# EAGLE design RH046.2 (EAGLE 7.7.0)
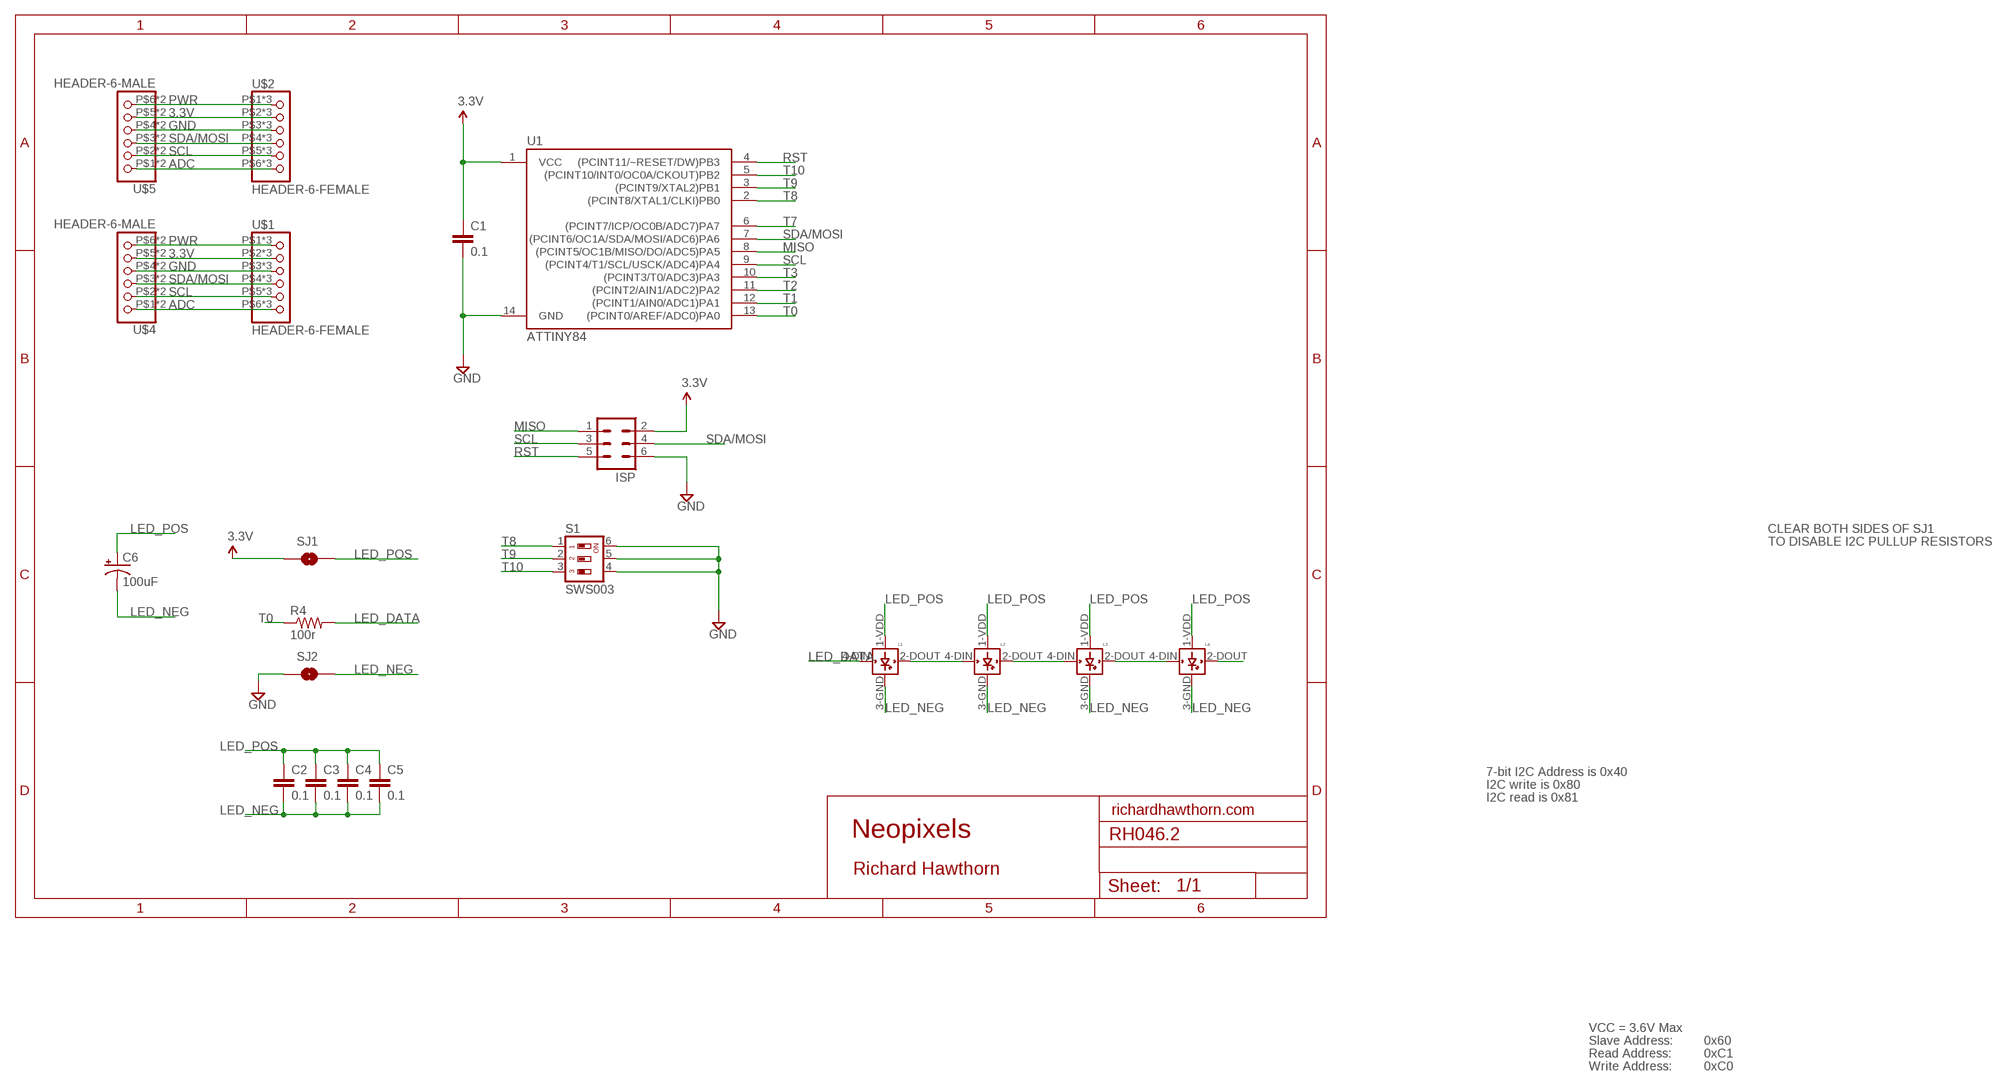
[diagram p0: schematic, sheet 1]

## Parts
C1  0.1  CAP0603-CAP  [0603-CAP]
C2  0.1  CAP0603-CAP  [0603-CAP]
C3  0.1  CAP0603-CAP  [0603-CAP]
C4  0.1  CAP0603-CAP  [0603-CAP]
C5  0.1  CAP0603-CAP  [0603-CAP]
C6  100uF  100UF-10V-10%(TANT)  [EIA7343]
ISP  MA03-2  [MA03-2]
L1  WS2812B  [WS2812B]
L2  WS2812B  [WS2812B]
L3  WS2812B  [WS2812B]
L4  WS2812B  [WS2812B]
R4  100r  RESISTOR0603-RES  [0603-RES]
S1  SWS003  [SMS-003]
SJ1  SOLDERJUMPERNO  [SJ_2S-NO]
SJ2  SOLDERJUMPERNO  [SJ_2S-NO]
U1  ATTINY84  [SO14]
U$1  HEADER-6-FEMALE  [2MMHEADER6]
U$2  HEADER-6-FEMALE  [2MMHEADER6]
U$4  HEADER-6-MALE  [2MMHEADERPIN6]
U$5  HEADER-6-MALE  [2MMHEADERPIN6]

## Nets
3.3V: C1.1 ISP.2 SJ1.1 U1.1(VCC) U$1.P$2 U$1.P$10 U$1.P$18 U$2.P$2 U$2.P$10 U$2.P$18 U$4.P$5 U$4.P$13 U$5.P$5 U$5.P$13
ADC: U$1.P$6 U$1.P$14 U$1.P$22 U$2.P$6 U$2.P$14 U$2.P$22 U$4.P$1 U$4.P$9 U$5.P$1 U$5.P$9
GND [power]: C1.2 ISP.6 S1.4 S1.5 S1.6 SJ2.1 U1.14(GND) U$1.P$3 U$1.P$11 U$1.P$19 U$2.P$3 U$2.P$11 U$2.P$19 U$4.P$4 U$4.P$12 U$5.P$4 U$5.P$12
LED-OUT-1: L1.2-DOUT(DOUT) L2.4-DIN(DIN)
LED-OUT-2: L3.2-DOUT(DOUT) L4.4-DIN(DIN)
LED-OUT-3: L4.2-DOUT(DOUT)
LED_DATA: L1.4-DIN(DIN) R4.2
LED_NEG [power]: C2.2 C3.2 C4.2 C5.2 C6.C(-) L1.3-GND(GND) L2.3-GND(GND) L3.3-GND(GND) L4.3-GND(GND) SJ2.2
LED_POS [power]: C2.1 C3.1 C4.1 C5.1 C6.A(+) L1.1-VDD(VDD) L2.1-VDD(VDD) L3.1-VDD(VDD) L4.1-VDD(VDD) SJ1.2
MISO: ISP.1 U1.8((PCINT5/OC1B/MISO/DO/ADC5)PA5)
N$6: L2.2-DOUT(DOUT) L3.4-DIN(DIN)
PWR [power]: U$1.P$1 U$1.P$9 U$1.P$17 U$2.P$1 U$2.P$9 U$2.P$17 U$4.P$6 U$4.P$14 U$5.P$6 U$5.P$14
RST: ISP.5 U1.4((PCINT11/~RESET/DW)PB3)
SCL: ISP.3 U1.9((PCINT4/T1/SCL/USCK/ADC4)PA4) U$1.P$5 U$1.P$13 U$1.P$21 U$2.P$5 U$2.P$13 U$2.P$21 U$4.P$2 U$4.P$10 U$5.P$2 U$5.P$10
SDA/MOSI: ISP.4 U1.7((PCINT6/OC1A/SDA/MOSI/ADC6)PA6) U$1.P$4 U$1.P$12 U$1.P$20 U$2.P$4 U$2.P$12 U$2.P$20 U$4.P$3 U$4.P$11 U$5.P$3 U$5.P$11
T0: R4.1 U1.13((PCINT0/AREF/ADC0)PA0)
T1: U1.12((PCINT1/AIN0/ADC1)PA1)
T2: U1.11((PCINT2/AIN1/ADC2)PA2)
T3: U1.10((PCINT3/T0/ADC3)PA3)
T7: U1.6((PCINT7/ICP/OC0B/ADC7)PA7)
T8: S1.1 U1.2((PCINT8/XTAL1/CLKI)PB0)
T9: S1.2 U1.3((PCINT9/XTAL2)PB1)
T10: S1.3 U1.5((PCINT10/INT0/OC0A/CKOUT)PB2)

## Notes on the sheet
- CLEAR BOTH SIDES OF SJ1
- TO DISABLE I2C PULLUP RESISTORS
- 7-bit I2C Address is 0x40
- I2C write is 0x80
- I2C read is 0x81
- richardhawthorn.com
- Neopixels
- Richard Hawthorn
- VCC = 3.6V Max
- Slave Address: | 0x60
- Read Address: | 0xC1
- Write Address: | 0xC0

## Library data of the parts
C1-C5 = LowPowerLab:CAP: Capacitor Standard 0603 ceramic capacitor, and 0.1" leaded capacitor.
C6 = SparkFun-Capacitors:100UF-10V-10%(TANT): CAP-07890; PROD_ID: CAP-07890
ISP = Richards:MA03-2: PIN HEADER; OC_FARNELL: unknown; OC_NEWARK: unknown
L1-L4 = adafruit:WS2812B
R4 = LowPowerLab:RESISTOR: Resistor Basic schematic elements and footprints for 0603, 1206, and PTH resistors.
S1 = smd-special:SWS003: SMD Dip Switch 3 pol.
SJ1 SJ2 = SparkFun-Retired:SOLDERJUMPER: Solder Jumper Standard SMD solder jumper. Used to automate production. Two varients : Normally Open and Normally Closed are the same, but have different paste layers. NC will have a large amount of paste and should jumper during reflow.
U1 = SparkFun-DigitalIC:ATTINY84: Atmel 14-pin 2/4/8kB flash uC
U$1 U$2 = Richards:HEADER-6-FEMALE
U$4 U$5 = Richards:HEADER-6-MALE

## Net classes
1 power: width 0.381 mm, clearance 0.254 mm

## Board
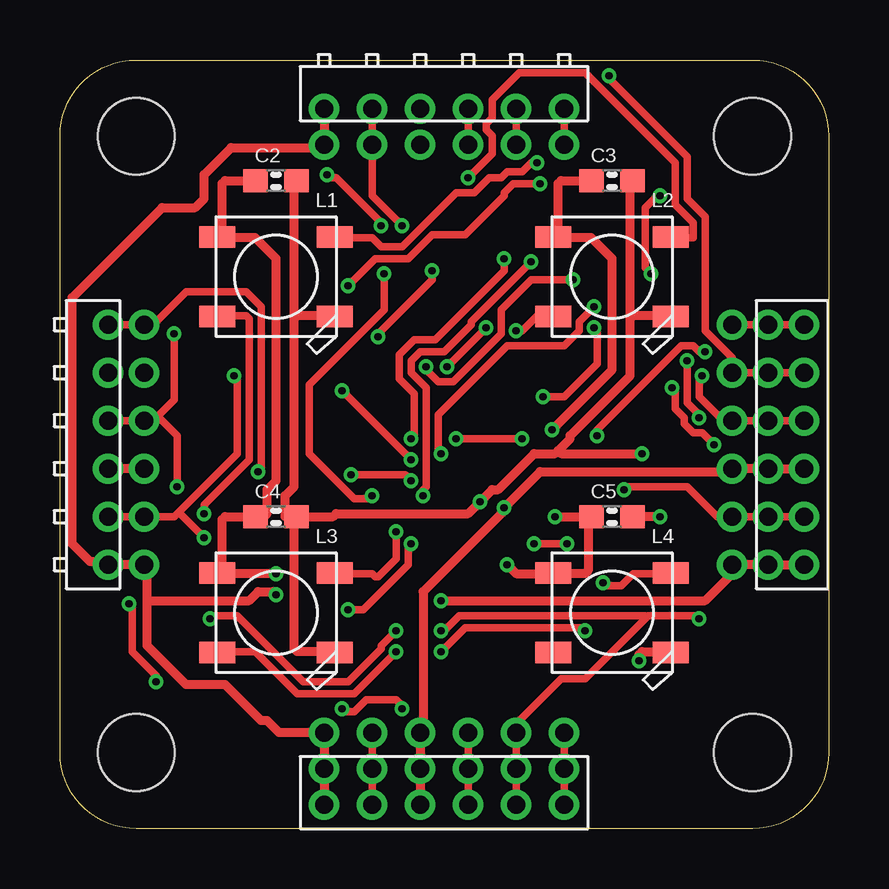
[diagram p1: board, top side]
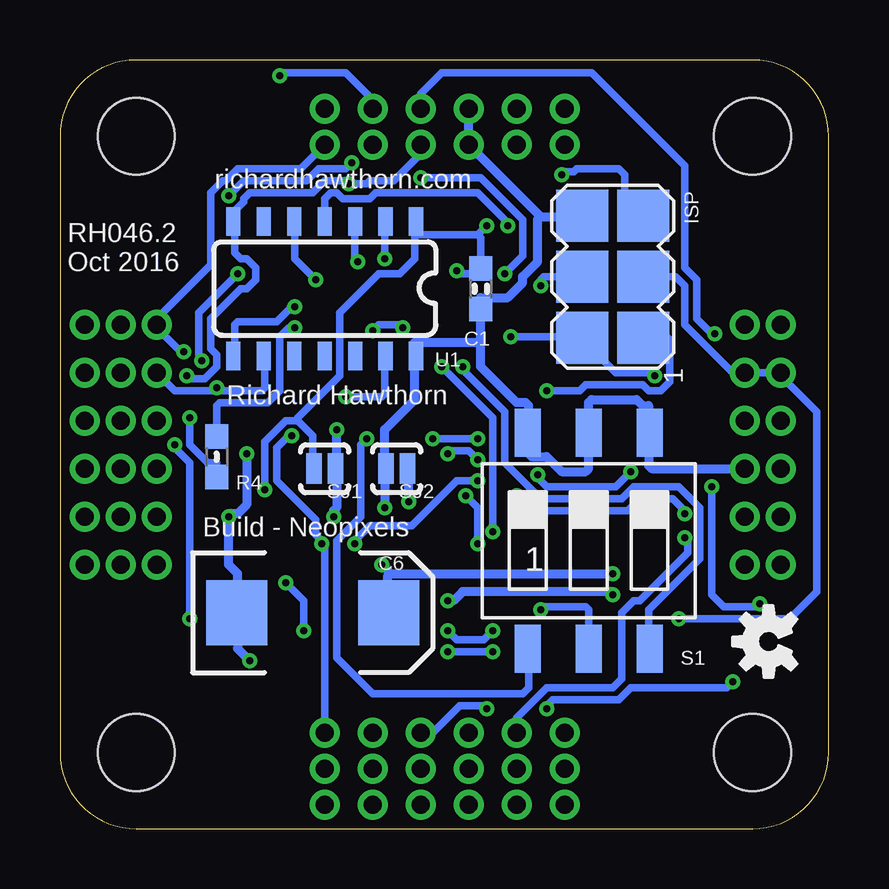
[diagram p2: board, bottom side, seen from below]

Size 32.03 x 32.03 mm. Coordinates in mm from the lower left corner, seen from the top.
Outline: 0,3.17 0,28.86 arc-90 3.17,32.03 28.86,32.03 arc-90 32.03,28.86 32.03,3.17 arc-90 28.86,0 3.17,0 arc-90 0,3.17
Copper layers (1*16): Top 0.035mm / dielectric 1.5mm / Bottom 0.035mm
Design rules "ITEADstudio_DRC *": minimum track width 12mil, minimum drill 12mil, track to track 6mil, track to pad 6mil, pad to pad 6mil, via to via 6mil, smd to smd 0mil, copper to edge 10mil, drill to drill 10mil, minimum pad ring 10mil, minimum via ring 6mil, stop-mask expansion 2mil, vias tented up to drill 100mil, thermal gap 15mil
Holes 3.2 mm at 3.17,3.17 28.86,3.17 3.17,28.86 28.86,28.86
tRestrict: area 0,0 to 5.7,5.7; area 26.3,0 to 32,5.7; area 26.3,26.3 to 32,32; area 0,26.3 to 5.7,32
bRestrict: area 0,26.3 to 5.7,32; area 26.3,26.3 to 32,32; area 26.3,0 to 32,5.7; area 0,0 to 5.7,5.7

### Footprints (pad centres in the part's own frame; a part is rotated, then mirrored left to right if it is on the bottom)
0603-CAP = smd 1.016 x 0.965: 1 -0.85,0; 2 0.85,0
EIA7343 = smd 2.55 x 2.7: A 3.17,0; C -3.17,0
MA03-2 = smd 2.159 x 2.159: 1 -2.54,-1.27; 2 -2.54,1.27; 3 0,-1.27; 4 0,1.27; 5 2.54,-1.27; 6 2.54,1.27
WS2812B = smd 1.5 x 0.9: 1-VDD 2.45,-1.65; 2-DOUT 2.45,1.65; 3-GND -2.45,1.65; 4-DIN -2.45,-1.65
0603-RES = smd 1.016 x 0.965: 1 -0.85,0; 2 0.85,0
SMS-003 = smd 1.092 x 2.007: 1 -2.54,-4.496; 2 0,-4.496; 3 2.54,-4.496; 4 2.54,4.496; 5 0,4.496; 6 -2.54,4.496
SJ_2S-NO = smd 0.635 x 1.27: 1 -0.45,0; 2 0.45,0
SO14 = smd 0.6 x 1.2: 1 -3.81,-2.8; 2 -2.54,-2.8; 3 -1.27,-2.8; 4 0,-2.8; 5 1.27,-2.8; 6 2.54,-2.8; 7 3.81,-2.8; 8 3.81,2.8; 9 2.54,2.8; 10 1.27,2.8; 11 0,2.8; 12 -1.27,2.8; 13 -2.54,2.8; 14 -3.81,2.8
2MMHEADER6 = drill 0.75: P$1 1,5; P$2 1,3; P$3 1,1; P$4 1,-1; P$5 1,-3; P$6 1,-5; P$9 -0.5,5; P$10 -0.5,3; P$11 -0.5,1; P$12 -0.5,-1; P$13 -0.5,-3; P$14 -0.5,-5; P$17 -2,5; P$18 -2,3; P$19 -2,1; P$20 -2,-1; P$21 -2,-3; P$22 -2,-5
2MMHEADERPIN6 = drill 0.75: P$1 1,5; P$2 1,3; P$3 1,1; P$4 1,-1; P$5 1,-3; P$6 1,-5; P$9 -0.5,5; P$10 -0.5,3; P$11 -0.5,1; P$12 -0.5,-1; P$13 -0.5,-3; P$14 -0.5,-5

### Placement (x,y rotation side)
C1  14.5,22.5 270 bottom
C2  9,27 0 top
C3  23,27 0 top
C4  9,13 0 top
C5  23,13 0 top
C6  21.5,9 0 bottom
ISP  9,23 90 bottom
L1  9,23 180 top
L2  23,23 180 top
L3  9,9 180 top
L4  23,9 180 top
R4  25.5,15.5 270 bottom
S1  10,12 0 bottom
SJ1  21,15 0 bottom
SJ2  18,15 0 bottom
U1  21,22.5 180 bottom
U$1  29,16 180 top
U$2  16,3 90 top
U$3  [OSHW-LOGO-S]  2.5,7.8 90 bottom
U$4  16,29.5 270 top
U$5  2.5,16 0 top

### Tracks (layer width: path | path; a pad name or v marks a point on that pad's centre or on a via)
3.3V  (via drill 0.3)
  Top 0.305: v23.5,14.12 23.62,14.25 26.12,14.25 27.38,13 U$1.P$2 U$1.P$10 U$1.P$18 | U$2.P$18 U$2.P$10 U$2.P$2 | U$4.P$13 U$4.P$5 13,26.38 v14.25,25.12 | U$5.P$13 U$5.P$5 4.75,13 4.94,13.19 | v13.25,20.5 13.25,20.62 15.5,22.88 v15.5,23.25 | 4.94,13.19 7.38,15.62 7.38,18.75 v7.25,18.88 | 4.94,13.19 v6,12.12
  Bottom 0.305: 22.12,17 21.5,16.38 21.5,15 SJ1.1 | 22.12,17 22.62,17 23.5,16.12 v23.5,14.12 | 14.62,24.75 14.5,24.62 C1.1 14.5,23.12 15.38,23.12 v15.5,23.25 | 17.25,24.75 14.62,24.75 | 17.25,24.75 17.25,25.25 U1.1 | v13.25,20.5 10.38,20.5 ISP.2 10.12,20.5 9.5,20.5 9.38,20.38 9.38,19.5 8.88,19 7.38,19 v7.25,18.88 | 14.62,24.75 v14.25,25.12 | U$2.P$2 13,4.62 11.75,5.88 9,5.88 8.62,6.25 8.62,9 8.12,9.5 7.88,9.5 5.88,11.5 5.88,12 v6,12.12 | 17.25,24.75 17.25,23.75 17.88,23.12 18.75,23.12 20.38,21.5 20.38,18.88 22.12,17.12 22.12,17
ADC  (via drill 0.3)
  Top 0.305: U$4.P$9 U$4.P$1 | U$1.P$6 U$1.P$14 U$1.P$22 | U$5.P$9 U$5.P$1 3.88,21 5.25,22.38 7.75,22.38 8.38,21.75 8.38,15 v8.25,14.88 | U$2.P$6 U$2.P$14 U$2.P$22 | v12.12,14.75 14.38,14.75 v14.62,14.5 | v21.12,11.88 v19.75,11.88 | v26.88,19.88 26.62,19.88 26.38,20.12 25.88,20.12 22.38,16.62 v22.38,16.38
  Bottom 0.305: U$4.P$1 22,27.5 24.62,27.5 25.12,27 25.25,27 25.75,26.5 25.75,23.5 28,21.25 U$1.P$6 28,20.88 27,19.88 v26.88,19.88 | v8.25,14.88 8.88,14.25 11.75,14.25 12.12,14.62 v12.12,14.75 | v14.62,14.5 15.5,14.5 17.38,12.62 19.12,12.62 19.75,12 v19.75,11.88 | U$2.P$6 21,11.75 v21.12,11.88 21.12,12 21.38,12.25 21.38,12.88 23,14.5 23,15.88 22.5,16.38 v22.38,16.38
GND  (via drill 0.3)
  Top 0.381: U$1.P$19 U$1.P$11 U$1.P$3 27.88,14.88 20,14.88 v18.5,13.38 18.5,13.25 15.12,9.88 15.12,4.12 U$2.P$3 U$2.P$11 U$2.P$19 | U$5.P$4 U$5.P$12
  Bottom 0.381: 12,25.5 10.38,25.5 ISP.6 | 12,25.5 U$4.P$4 U$4.P$12 | 14.5,20.25 14.5,19.25 13,17.75 12.62,17.75 12.5,17.62 12.5,16.5 S1.6 12.5,16.38 12.5,15.62 12.38,15.5 11.75,15.5 11.12,14.88 10.12,14.88 10,15 S1.5 10,17.75 9.88,17.88 8,17.88 7.75,17.62 7.5,17.62 7.5,16.5 S1.4 7.5,16.38 7.5,15.12 7.38,15 U$5.P$4 | 14.5,20.25 C1.2 14.5,22.12 13.38,22.12 12.75,22.75 12.75,23 12.12,23.62 12.12,25.38 12,25.5 | 14.5,20.25 17.25,20.25 17.25,19.88 U1.14 17.25,19.62 17.25,17.88 18.5,16.62 18.5,15 SJ2.1 18.5,14.88 v18.5,13.38
LED-OUT-1  (via drill 0.3)
  Top 0.305: v17,27.12 18,28.12 18,28.88 17.75,29.12 17.75,29.38 18,29.62 18,30.38 19.12,31.5 21.88,31.5 25.62,27.75 25.62,26 26.38,25.25 26.38,24.62 25.5,24.62 L2.4-DIN | v13.5,23.12 13.5,21.62 10.38,18.5 10.38,15.62 12.25,13.75 12.88,13.75 v13,13.88 | v6,13.12 6,13.5 7.88,15.38 7.88,21.25 7.75,21.38 6.62,21.38 L1.2-DOUT
  Bottom 0.305: v17,27.12 14.5,27.12 12.75,25.38 12.75,23.88 v13.5,23.12 | v13,13.88 12.88,13.88 12.25,13.25 8.38,13.25 7.88,13.75 6.5,13.75 6,13.25 v6,13.12
LED-OUT-2  (via drill 0.3)
  Top 0.305: v14,7.38 12.25,5.62 9.88,5.62 8.12,7.38 6.62,7.38 L3.2-DOUT | v15.88,7.38 16.88,8.38 21.75,8.38 v21.88,8.25 | v22.62,10.25 22.75,10.12 23.38,10.12 23.88,10.62 25.38,10.62 L4.4-DIN
  Bottom 0.305: v15.88,7.38 v14,7.38 | v21.88,8.25 21.88,9.5 v22.62,10.25
LED_DATA  (via drill 0.3)
  Top 0.305: v26.62,17.12 26.62,17.25 26.12,17.75 v26.12,19.5 | v24.62,23.12 24.38,23.38 24.38,25.88 24.88,26.38 v25,26.38 | v19.88,27.75 19.62,27.75 19.25,27.38 18.62,27.38 18.38,27.12 17.88,27.12 17.25,26.5 16.5,26.5 14.25,24.25 13.38,24.25 13,24.62 11.5,24.62 L1.4-DIN
  Bottom 0.305: R4.2 25.5,15.25 25.88,15.25 26.62,16 v26.62,17.12 | v26.12,19.5 26.12,19.62 26.25,19.75 26.25,21.5 v24.62,23.12 | v25,26.38 24.38,27 21.75,27 21.25,27.5 20.12,27.5 v19.88,27.75
LED_NEG  (via drill 0.3)
  Top 0.381: v25,13 C5.2 | v24.12,7 24.12,7.25 24.25,7.38 25.38,7.38 L4.3-GND | 23.88,21.38 23.75,21.5 23.75,27 C3.2 | 23.88,21.38 25.38,21.38 L2.3-GND | 9.88,21.38 9.75,21.5 9.75,27 C2.2 | 9.88,21.38 11.38,21.38 L1.3-GND | C4.2 9.75,13 9.75,7.5 9.88,7.38 11.38,7.38 L3.3-GND | C4.2 11.38,13 11.5,13.12 17,13.12 v17.5,13.62 18,14.12 18.25,14.12 19.75,15.62 20.62,15.62 20.75,15.75 | C4.2 9.38,13 9.38,13.88 9.75,14.25 9.75,21.25 9.88,21.38 | 20.75,15.75 21.25,16.25 21.25,16.38 23.75,18.88 23.75,21.25 23.88,21.38 | v24.25,15.62 20.88,15.62 20.75,15.75
  Bottom 0.381: v24.12,7 24.62,7.5 24.62,8.88 C6.C 24.62,9 24.62,10.62 25,11 v25,13 24.88,13.12 24.62,13.12 24.25,13.5 v24.25,15.62 | v17.5,13.62 17.5,15 SJ2.2
LED_POS  (via drill 0.3)
  Top 0.381: C3.1 20.88,27 20.75,26.88 20.75,24.62 20.62,24.62 L2.1-VDD 20.88,24.62 22.12,24.62 23,23.75 23,19.12 v20.5,16.62 | v20.62,13 C5.1 22,12.88 22,10.75 21.88,10.62 20.62,10.62 L4.1-VDD 20.38,10.62 19,10.62 v18.62,11 | C2.1 6.88,27 6.75,26.88 6.75,24.62 6.62,24.62 L1.1-VDD 6.88,24.62 8.12,24.62 9,23.75 9,14.5 8.62,14.12 8.62,13.12 8.5,13 C4.1 6.88,13 6.75,12.88 6.75,10.62 6.62,10.62 L3.1-VDD 6.88,10.62 v9,10.62
  Bottom 0.381: v20.62,13 20.62,13.25 20.5,13.38 20.5,15 SJ1.2 20.5,15.12 v20.5,16.62 | 18.25,10.62 v9,10.62 | 18.25,10.62 18.38,10.5 18.38,9 C6.A | 18.25,10.62 v18.62,11
MISO  (via drill 0.3)
  Top 0.305: v22.25,21.75 21.62,21.12 21.62,20.75 21,20.12 18.62,20.12 15.75,17.25 15.75,15.75 v15.88,15.62 | v11.75,18.25 v14.62,15.38
  Bottom 0.305: v22.25,21.75 22.38,21.75 23,21.12 24.62,21.12 24.75,21 24.75,19.75 U1.8 | v15.88,15.62 15.75,15.75 15,15.75 v14.62,15.38 | v11.75,18.25 10.38,18.25 10.12,18.5 7.75,18.5 7.5,18.25 7,18.25 6.62,18.62 6.62,20.38 6.75,20.5 7.62,20.5 ISP.1
N$6  (via drill 0.3)
  Top 0.305: v19,20.75 19.25,20.75 19.88,21.38 20.5,21.38 L2.2-DOUT | v16.12,19.25 v17.75,20.88 | v14,12.38 14,11.25 13.25,10.5 13.12,10.5 13,10.62 11.5,10.62 L3.4-DIN
  Bottom 0.305: v19,20.75 18.75,21 17.88,21 v17.75,20.88 | v16.12,19.25 14,17.12 v14,12.38
PWR  (via drill 0.3)
  Top 0.381: U$1.P$17 U$1.P$9 U$1.P$1 27.88,10.88 27.88,10.5 26.88,9.5 v15.88,9.5 | U$4.P$14 U$4.P$6 10.88,28.38 7.12,28.38 6,27.25 6,26.25 5.62,25.88 4.25,25.88 0.5,22.12 0.5,11.88 1.25,11.12 1.88,11.12 U$5.P$14 U$5.P$6 3.62,10.88 3.62,9.5 | U$2.P$17 U$2.P$9 U$2.P$1 9.12,4 8.62,4.5 8.38,4.5 6.88,6 5.25,6 3.62,7.62 3.62,9.5 | v9,9.75 8.88,9.88 8.25,9.88 7.88,9.5 3.62,9.5
  Bottom 0.381: v15.88,9.5 15.62,9.5 15.25,9.88 9.12,9.88 v9,9.75
RST  (via drill 0.3)
  Top 0.305: v13.38,25.12 13.38,25.25 11.5,27.12 11.25,27.12 v11.12,27.25
  Bottom 0.305: U1.4 21,26.25 20.75,26.5 20.5,26.5 20.25,26.25 19.12,26.25 18.88,26.5 14.62,26.5 13.38,25.25 v13.38,25.12 | v11.12,27.25 11,27.38 10.62,27.38 10.5,27.5 8.75,27.5 8.5,27.25 8.5,25.5 7.75,25.5 ISP.5
SCL  (via drill 0.3)
  Top 0.305: U$2.P$21 U$2.P$13 U$2.P$5 19,4.38 20.88,6.25 21.88,6.25 24.44,8.81 | U$4.P$10 U$4.P$2 | U$1.P$21 U$1.P$13 U$1.P$5 28,19.62 26.88,20.75 26.88,25.5 26.12,26.25 26.12,28 22.88,31.25 v22.88,31.38 | 24.44,8.81 24.5,8.88 26.5,8.88 v26.62,8.75 | v27.25,16 26.75,16.5 26.38,16.5 26,16.88 26,17.12 25.62,17.5 25.62,18.25 v25.5,18.38 | v6.25,8.75 6.38,8.88 7.38,8.88 10.12,6.12 12,6.12 13.38,7.5 13.38,7.62 v14,8.25 | v15.88,8.25 16,8.25 16.62,8.88 24.38,8.88 24.44,8.81
  Bottom 0.305: ISP.3 6.38,23 6,22.62 6,21 4,19 U$5.P$2 U$5.P$10 2,18.88 0.5,17.38 0.5,9.88 1.62,8.75 v6.25,8.75 | 25.5,18.25 27.25,18.25 U$1.P$5 | 25.5,18.25 23.62,18.25 23.5,18.38 23.5,19.62 U1.9 | U$4.P$10 19,30.38 20.12,31.5 22.75,31.5 v22.88,31.38 | v26.62,8.75 26.62,15.25 27.25,15.88 v27.25,16 | v25.5,18.38 25.5,18.25 | v14,8.25 14.38,7.88 15.5,7.88 v15.88,8.25
SDA/MOSI  (via drill 0.3)
  Top 0.305: v26.75,18.88 26.62,18.75 26.62,18 27.62,17 U$1.P$4 U$1.P$12 U$1.P$20 | v12,22.62 13.12,23.75 14.5,23.75 15.5,24.75 16.88,24.75 18.5,26.38 18.5,26.5 18.88,26.88 v20,26.88 | U$2.P$20 U$2.P$12 U$2.P$4 | U$5.P$3 U$5.P$11 | U$4.P$11 U$4.P$3 | U$5.P$3 3.88,17 4.75,17.88 v4.75,20.62 | v14.25,5 14.25,5.12 14,5.38 12.75,5.38 12.25,4.88 11.88,4.88 v11.75,5 | v4,6.12 4,6.38 3,7.38 3,9.25 v2.88,9.38 | v4.88,14.25 4.88,16.38 4.12,17.12 U$5.P$3
  Bottom 0.305: v26.75,18.88 26.62,18.75 26,18.75 25.5,19.25 25.5,19.75 25.75,20 25.75,21.25 24.5,22.5 24.25,22.5 23.88,22.88 23.88,23.38 24.25,23.75 24.5,23.75 24.75,24 24.75,25.25 U1.7 24.75,25.38 24.75,25.75 24.38,26.12 24.38,26.25 24.12,26.5 21.5,26.5 21,27 20.12,27 v20,26.88 19.25,26.88 19.12,27 18.12,27 17,28.12 U$4.P$3 | ISP.4 11.88,23 12,22.88 v12,22.62 | v4.75,20.62 4.88,20.62 5.5,21.25 5.5,22.88 6,23.38 6,27.62 9.88,31.5 16.12,31.5 17,30.62 U$4.P$11 | U$2.P$4 16.5,4 15.38,5.12 14.38,5.12 v14.25,5 | v11.75,5 11.75,5.12 11.5,5.38 8.75,5.38 8.25,5.88 4.25,5.88 v4,6.12 | v2.88,9.38 3,9.25 4.38,9.25 4.88,9.75 v4.88,14.25
T0  (via drill 0.3)
  Top 0.305: v22.25,20.88 22.38,20.75 22.38,19.38 21,18 v20.12,18
  Bottom 0.305: R4.1 25.5,17.62 25.38,17.75 23.38,17.75 22.88,18.25 22.88,20.5 22.5,20.88 v22.25,20.88 | v20.12,18 18.62,18 18.5,18.12 18.5,19.62 U1.13
T8  (via drill 0.3)
  Top 0.305: v18.5,23.75 18.5,23.25 15.62,20.38 14.75,20.38 14.12,19.75 14.12,18.75 14.75,18.12 14.75,16.38 v14.62,16.25 | v19.25,16.25 v16.5,16.25
  Bottom 0.305: v18.5,23.75 18.5,25.25 U1.2 | v16.5,16.25 v14.62,16.25 | v19.25,16.25 19.5,16 19.5,13 20.5,12 20.5,7.12 19,5.62 12.75,5.62 12.5,5.88 12.5,7.5 S1.1
T9  (via drill 0.3)
  Top 0.305: v12,9.12 12.62,9.12 14.5,11 14.5,11.75 v14.62,11.88 | v15.12,13.88 15.12,14.12 15.25,14.25 15.25,18.38 14.62,19 14.62,19.5 15,19.88 16,19.88 17.12,21 17.12,21.12 v19.62,23.62
  Bottom 0.305: S1.2 10,9.12 10.12,9.25 11.88,9.25 v12,9.12 | v14.62,11.88 14.62,13.38 v15.12,13.88 | v19.62,23.62 19.75,23.75 19.75,25.25 U1.3
T10  (via drill 0.3)
  Top 0.305: v21.38,22.88 19.62,22.88 18.38,21.62 18.38,20.62 16.38,18.62 15.75,18.62 15.25,19.12 v15.25,19.25
  Bottom 0.305: v21.38,22.88 22.25,23.75 22.25,25.25 U1.5 | v15.25,19.25 15.25,19.12 13.5,17.38 13.5,15.25 12,13.75 8.62,13.75 8.12,14.25 6.25,14.25 5.38,13.38 5.38,11.25 7.5,9.12 7.5,7.62 S1.3

### Text on the board
bPlace: richardhawthorn.com | RH046.2 / Oct 2016 | Richard Hawthorn | Build - Neopixels
tDocu: REG